# Altium schematic sheet LittleButtons.SchDoc
size Letter; CompanyName: PloopyCo; Organization: Ploopy Co; Address1: 137-1140 Burnhamthorpe Road W; Address2: Mississauga; Address3: Ontario; Address4: Canada L5C 0A3; DocumentNumber: 2; Revision: R1.004; SheetNumber: 2; SheetTotal: 8
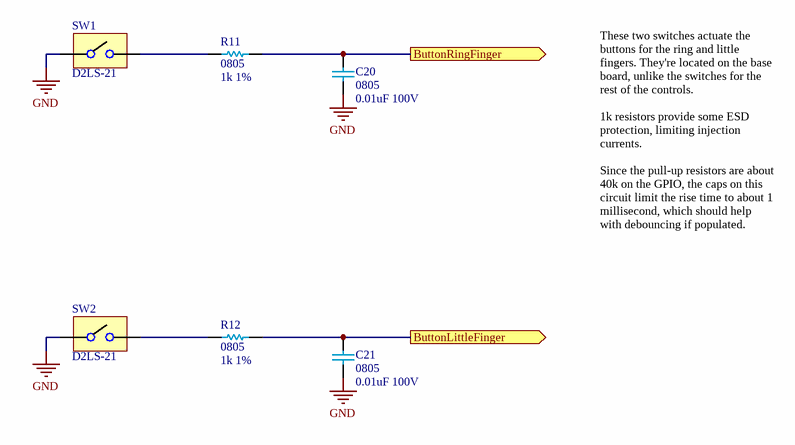
[diagram p0: LittleButtons.SchDoc]

## Parts
C20  0805  value 0.01uF 100V  [C0603]
C21  0805  value 0.01uF 100V  [C0603]
R11  0805  value 1k 1%  [0603]
R12  0805  value 1k 1%  [0603]
SW1  D2LS-21  [D2LS-21]
SW2  D2LS-21  [D2LS-21]

## Ports
ButtonLittleFinger (out), ButtonRingFinger (out)

## Nets
GND: C20.1 C21.1 SW1.A SW2.A
ButtonLittleFinger: C21.2 R12.2 ; port ButtonLittleFinger
ButtonRingFinger: C20.2 R11.2 ; port ButtonRingFinger
NetR11_1: R11.1 SW1.B
NetR12_1: R12.1 SW2.B

## Notes on the sheet
- These two switches actuate the buttons for the ring and little fingers. They're located on the base board, unlike the switches for the rest of the controls.
  1k resistors provide some ESD protection, limiting injection currents.
  Since the pull-up resistors are about 40k on the GPIO, the caps on this circuit limit the rise time to about 1 millisecond, which should help with debouncing if populated.
- Copyright Ploopy Corporation 2019
- Licensed under the CERN OHL v. 1.2
- http://ohwr.org/cernohl
- Title:
- PCB:
- Version:
- Ploopy Corporation
- Mississauga ON L5C 0A3
- 137-1140 Burnhamthorpe Road W
- Date:
- Time:
- Sheet
- of
- Canada

## Library data of the parts
C20 C21 = Cap 0.01uF 100V: 0805, X5R or better; PNP-Nzl: 2; PNP-dx: 0; PNP-X: 2.00; PNP-Y: 1.25; PNP-Thk: 0.85; PNP-Lv: 1; PNP-TS: 70; PNP-Type: chi; PNP-FeedType: Tape; PNP-TapeWidth: 8; PNP-dy: 0; PNP-Pt: 0; PNP-W: 0; PNP-Level: 1; PNP-Voff: 0; PNP-PlacePriority: 1; PNP-A: 0; PNP-TapeIndex: 1; Supplier 1: Digi-Key; Supplier Part Number 1: 1276-6845-2-ND; Supplier 2: Arrow; Supplier Part Number 2: HFLC7Kmwq4-6R2SVzaQAUvCwxvZH1YjWdj_EBba1ByE; PNP-da: 0
R11 R12 = Res 1k 1% 0805: Chip resistor, 1/8W 100PPM; PNP-Nzl: 2; PNP-dx: 0; PNP-X: 2.00; PNP-Y: 1.25; PNP-Thk: 0.55; PNP-Lv: 1; PNP-TS: 70; PNP-Type: chi; PNP-FeedType: Tape; PNP-TapeWidth: 8; Supplier 1: Digi-Key; Supplier Part Number 1: RMCF0805FT1K00TR-ND; PNP-dy: 0; PNP-Pt: 0; PNP-W: 0; PNP-Level: 1; PNP-Voff: 0; PNP-PlacePriority: 1; PNP-A: 0; PNP-TapeIndex: 1; PNP-da: 0
SW1 SW2 = D2LS-21: Compact Surface-mounting Switch for long durability; Supplier 1: Digi-Key; Supplier 2: Mouser; Supplier Part Number 1: Z4378CT-ND; Supplier Part Number 2: 653-D2LS-21